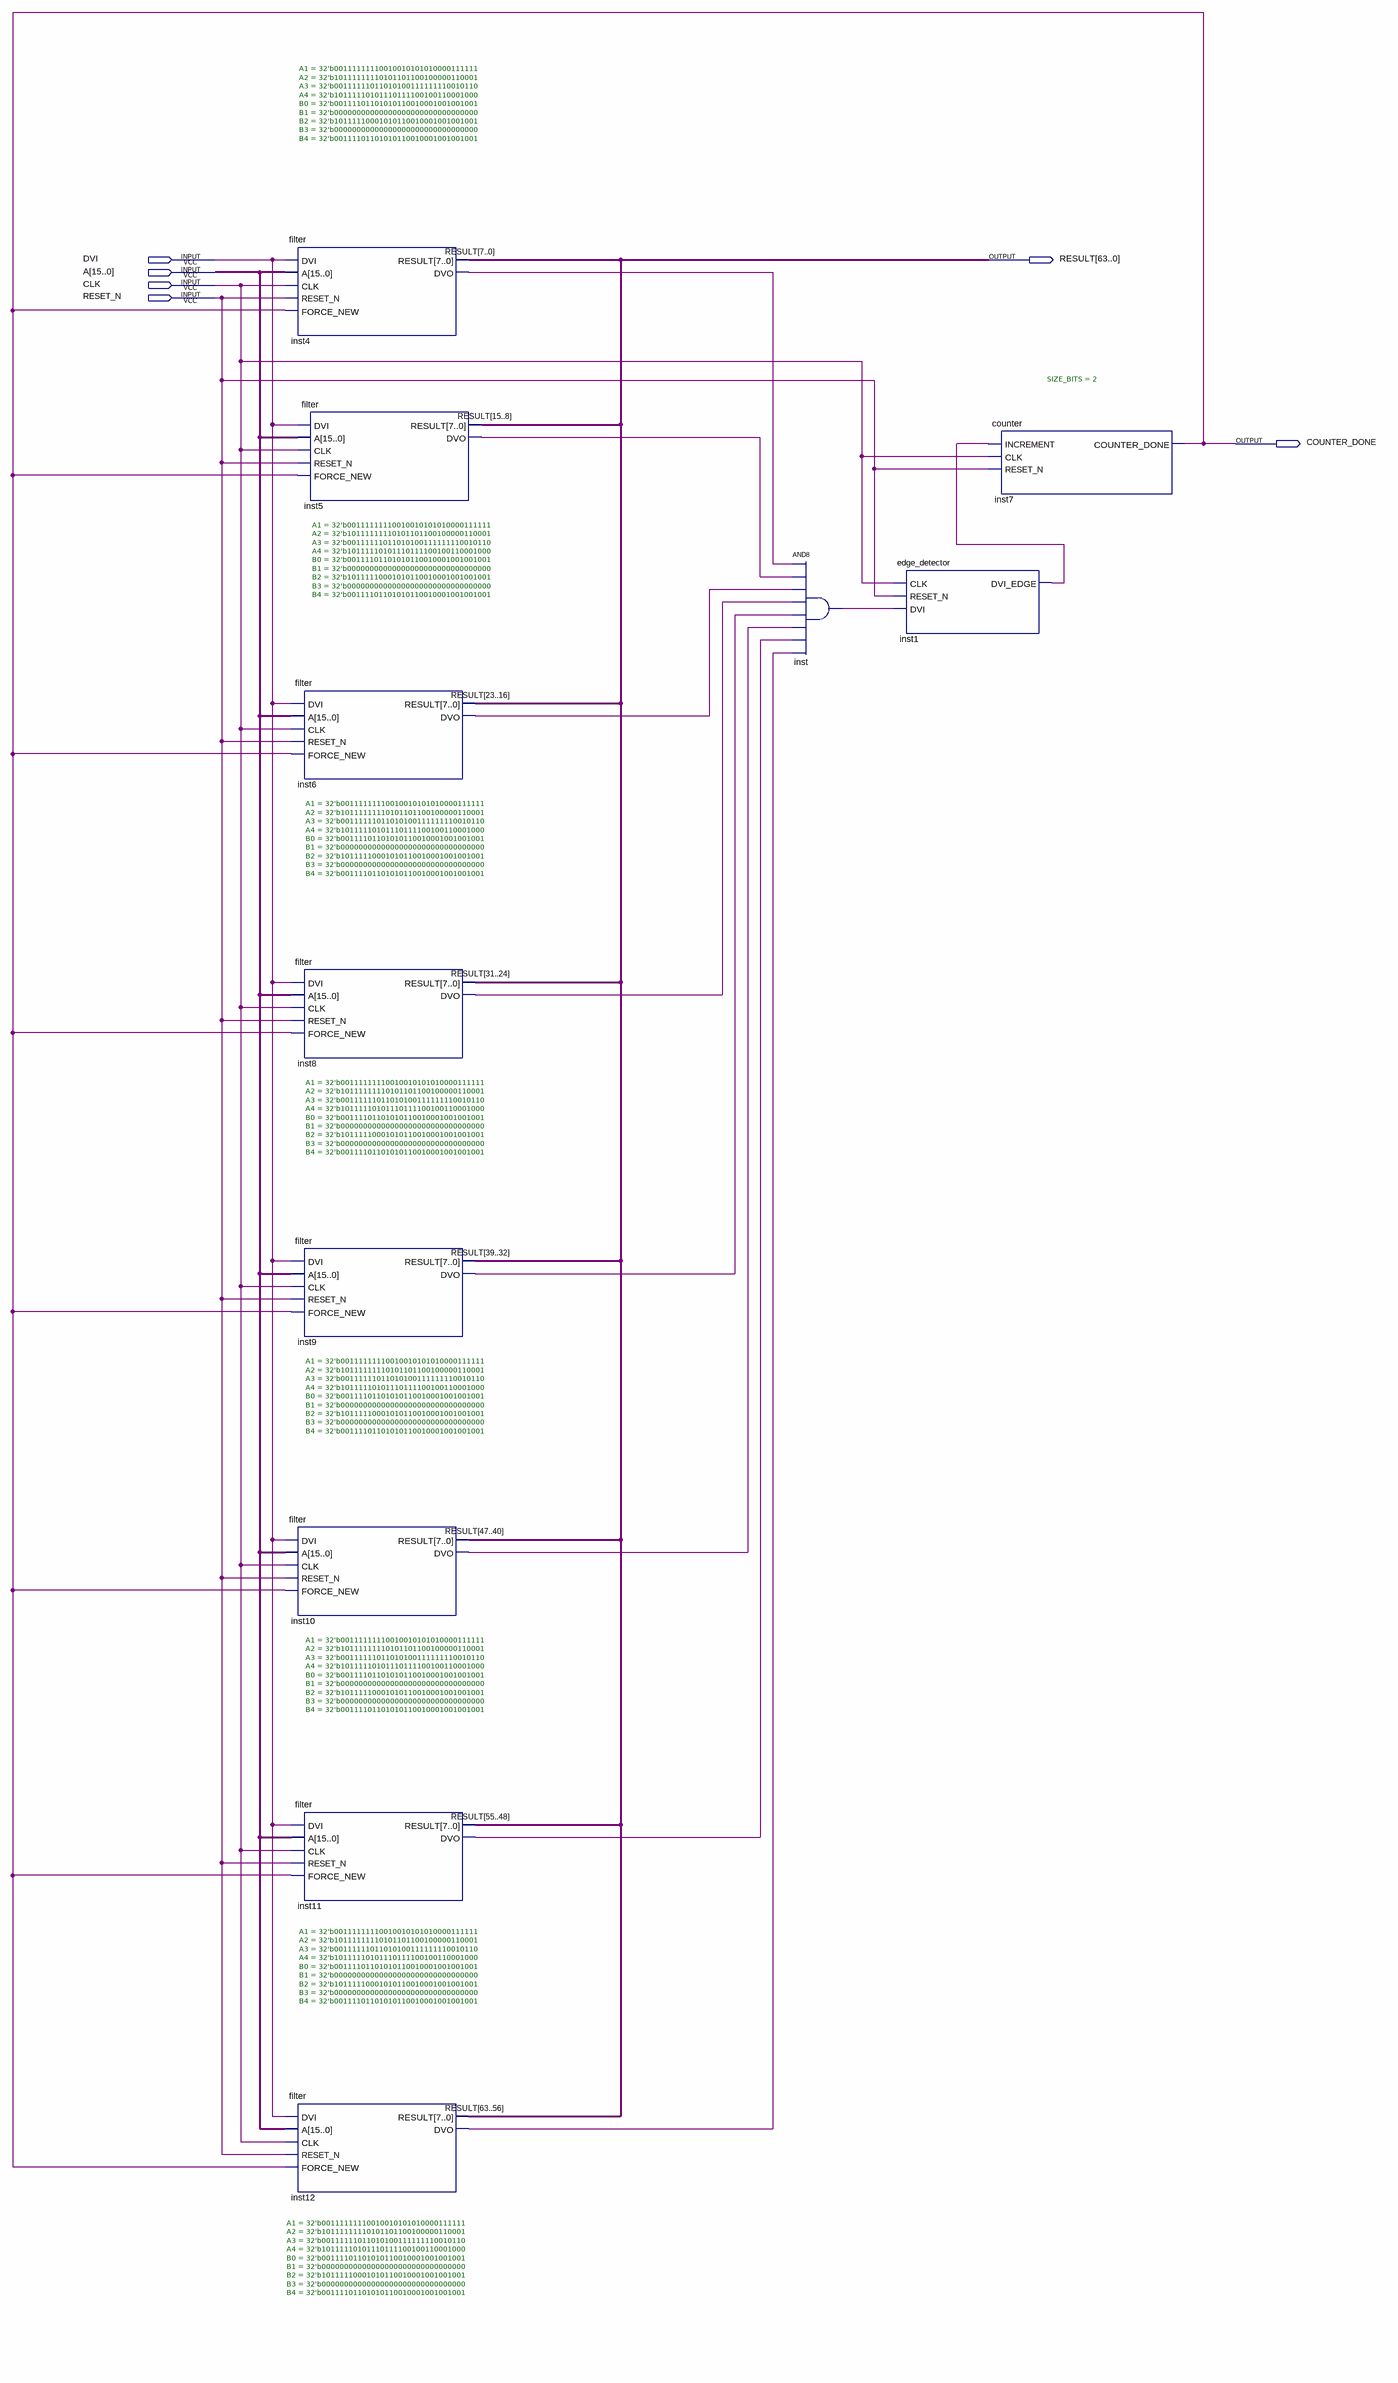
[diagram p0: schematic sheet]
// Quartus schematic StudentDesign.bdf as structural Verilog: 11 symbols, 6 pins
module StudentDesign (
  input  DVI,
  input  [15:0] A,
  input  CLK,
  input  RESET_N,
  output [63:0] RESULT,
  output COUNTER_DONE
);

  wire inst1_dvi_edge, inst4_dvo, inst5_dvo, inst6_dvo, inst8_dvo, inst9_dvo, inst10_dvo, inst11_dvo,
       inst12_dvo, inst_out;

  filter #(.A1(32'b00111111110010010101010000111111), .A2(32'b10111111110101101100100000110001), .A3(32'b00111111011010100111111110010110), .A4(32'b10111110101110111100100110001000), .B0(32'b00111101101010110010001001001001), .B1(32'b00000000000000000000000000000000), .B2(32'b10111110001010110010001001001001), .B3(32'b00000000000000000000000000000000), .B4(32'b00111101101010110010001001001001)) inst4 (
    .DVI(DVI), .A(A), .CLK(CLK), .RESET_N(RESET_N), .FORCE_NEW(COUNTER_DONE), .RESULT(RESULT[7:0]),
    .DVO(inst4_dvo));
  filter #(.A1(32'b00111111110010010101010000111111), .A2(32'b10111111110101101100100000110001), .A3(32'b00111111011010100111111110010110), .A4(32'b10111110101110111100100110001000), .B0(32'b00111101101010110010001001001001), .B1(32'b00000000000000000000000000000000), .B2(32'b10111110001010110010001001001001), .B3(32'b00000000000000000000000000000000), .B4(32'b00111101101010110010001001001001)) inst10 (
    .DVI(DVI), .A(A), .CLK(CLK), .RESET_N(RESET_N), .FORCE_NEW(COUNTER_DONE), .RESULT(RESULT[47:40]),
    .DVO(inst10_dvo));
  filter #(.A1(32'b00111111110010010101010000111111), .A2(32'b10111111110101101100100000110001), .A3(32'b00111111011010100111111110010110), .A4(32'b10111110101110111100100110001000), .B0(32'b00111101101010110010001001001001), .B1(32'b00000000000000000000000000000000), .B2(32'b10111110001010110010001001001001), .B3(32'b00000000000000000000000000000000), .B4(32'b00111101101010110010001001001001)) inst12 (
    .DVI(DVI), .A(A), .CLK(CLK), .RESET_N(RESET_N), .FORCE_NEW(COUNTER_DONE), .RESULT(RESULT[63:56]),
    .DVO(inst12_dvo));
  filter #(.A1(32'b00111111110010010101010000111111), .A2(32'b10111111110101101100100000110001), .A3(32'b00111111011010100111111110010110), .A4(32'b10111110101110111100100110001000), .B0(32'b00111101101010110010001001001001), .B1(32'b00000000000000000000000000000000), .B2(32'b10111110001010110010001001001001), .B3(32'b00000000000000000000000000000000), .B4(32'b00111101101010110010001001001001)) inst5 (
    .DVI(DVI), .A(A), .CLK(CLK), .RESET_N(RESET_N), .FORCE_NEW(COUNTER_DONE), .RESULT(RESULT[15:8]),
    .DVO(inst5_dvo));
  filter #(.A1(32'b00111111110010010101010000111111), .A2(32'b10111111110101101100100000110001), .A3(32'b00111111011010100111111110010110), .A4(32'b10111110101110111100100110001000), .B0(32'b00111101101010110010001001001001), .B1(32'b00000000000000000000000000000000), .B2(32'b10111110001010110010001001001001), .B3(32'b00000000000000000000000000000000), .B4(32'b00111101101010110010001001001001)) inst6 (
    .DVI(DVI), .A(A), .CLK(CLK), .RESET_N(RESET_N), .FORCE_NEW(COUNTER_DONE), .RESULT(RESULT[23:16]),
    .DVO(inst6_dvo));
  filter #(.A1(32'b00111111110010010101010000111111), .A2(32'b10111111110101101100100000110001), .A3(32'b00111111011010100111111110010110), .A4(32'b10111110101110111100100110001000), .B0(32'b00111101101010110010001001001001), .B1(32'b00000000000000000000000000000000), .B2(32'b10111110001010110010001001001001), .B3(32'b00000000000000000000000000000000), .B4(32'b00111101101010110010001001001001)) inst8 (
    .DVI(DVI), .A(A), .CLK(CLK), .RESET_N(RESET_N), .FORCE_NEW(COUNTER_DONE), .RESULT(RESULT[31:24]),
    .DVO(inst8_dvo));
  filter #(.A1(32'b00111111110010010101010000111111), .A2(32'b10111111110101101100100000110001), .A3(32'b00111111011010100111111110010110), .A4(32'b10111110101110111100100110001000), .B0(32'b00111101101010110010001001001001), .B1(32'b00000000000000000000000000000000), .B2(32'b10111110001010110010001001001001), .B3(32'b00000000000000000000000000000000), .B4(32'b00111101101010110010001001001001)) inst9 (
    .DVI(DVI), .A(A), .CLK(CLK), .RESET_N(RESET_N), .FORCE_NEW(COUNTER_DONE), .RESULT(RESULT[39:32]),
    .DVO(inst9_dvo));
  filter #(.A1(32'b00111111110010010101010000111111), .A2(32'b10111111110101101100100000110001), .A3(32'b00111111011010100111111110010110), .A4(32'b10111110101110111100100110001000), .B0(32'b00111101101010110010001001001001), .B1(32'b00000000000000000000000000000000), .B2(32'b10111110001010110010001001001001), .B3(32'b00000000000000000000000000000000), .B4(32'b00111101101010110010001001001001)) inst11 (
    .DVI(DVI), .A(A), .CLK(CLK), .RESET_N(RESET_N), .FORCE_NEW(COUNTER_DONE), .RESULT(RESULT[55:48]),
    .DVO(inst11_dvo));
  and inst (inst_out, inst4_dvo, inst5_dvo, inst6_dvo, inst8_dvo, inst9_dvo, inst10_dvo, inst11_dvo, inst12_dvo);
  edge_detector inst1 (.CLK(CLK), .RESET_N(RESET_N), .DVI(inst_out), .DVI_EDGE(inst1_dvi_edge));
  counter #(.SIZE_BITS(2)) inst7 (
    .INCREMENT(inst1_dvi_edge), .CLK(CLK), .RESET_N(RESET_N), .COUNTER_DONE(COUNTER_DONE));
endmodule
